# Altium project GSMMHMUltraSlim.PrjPcb
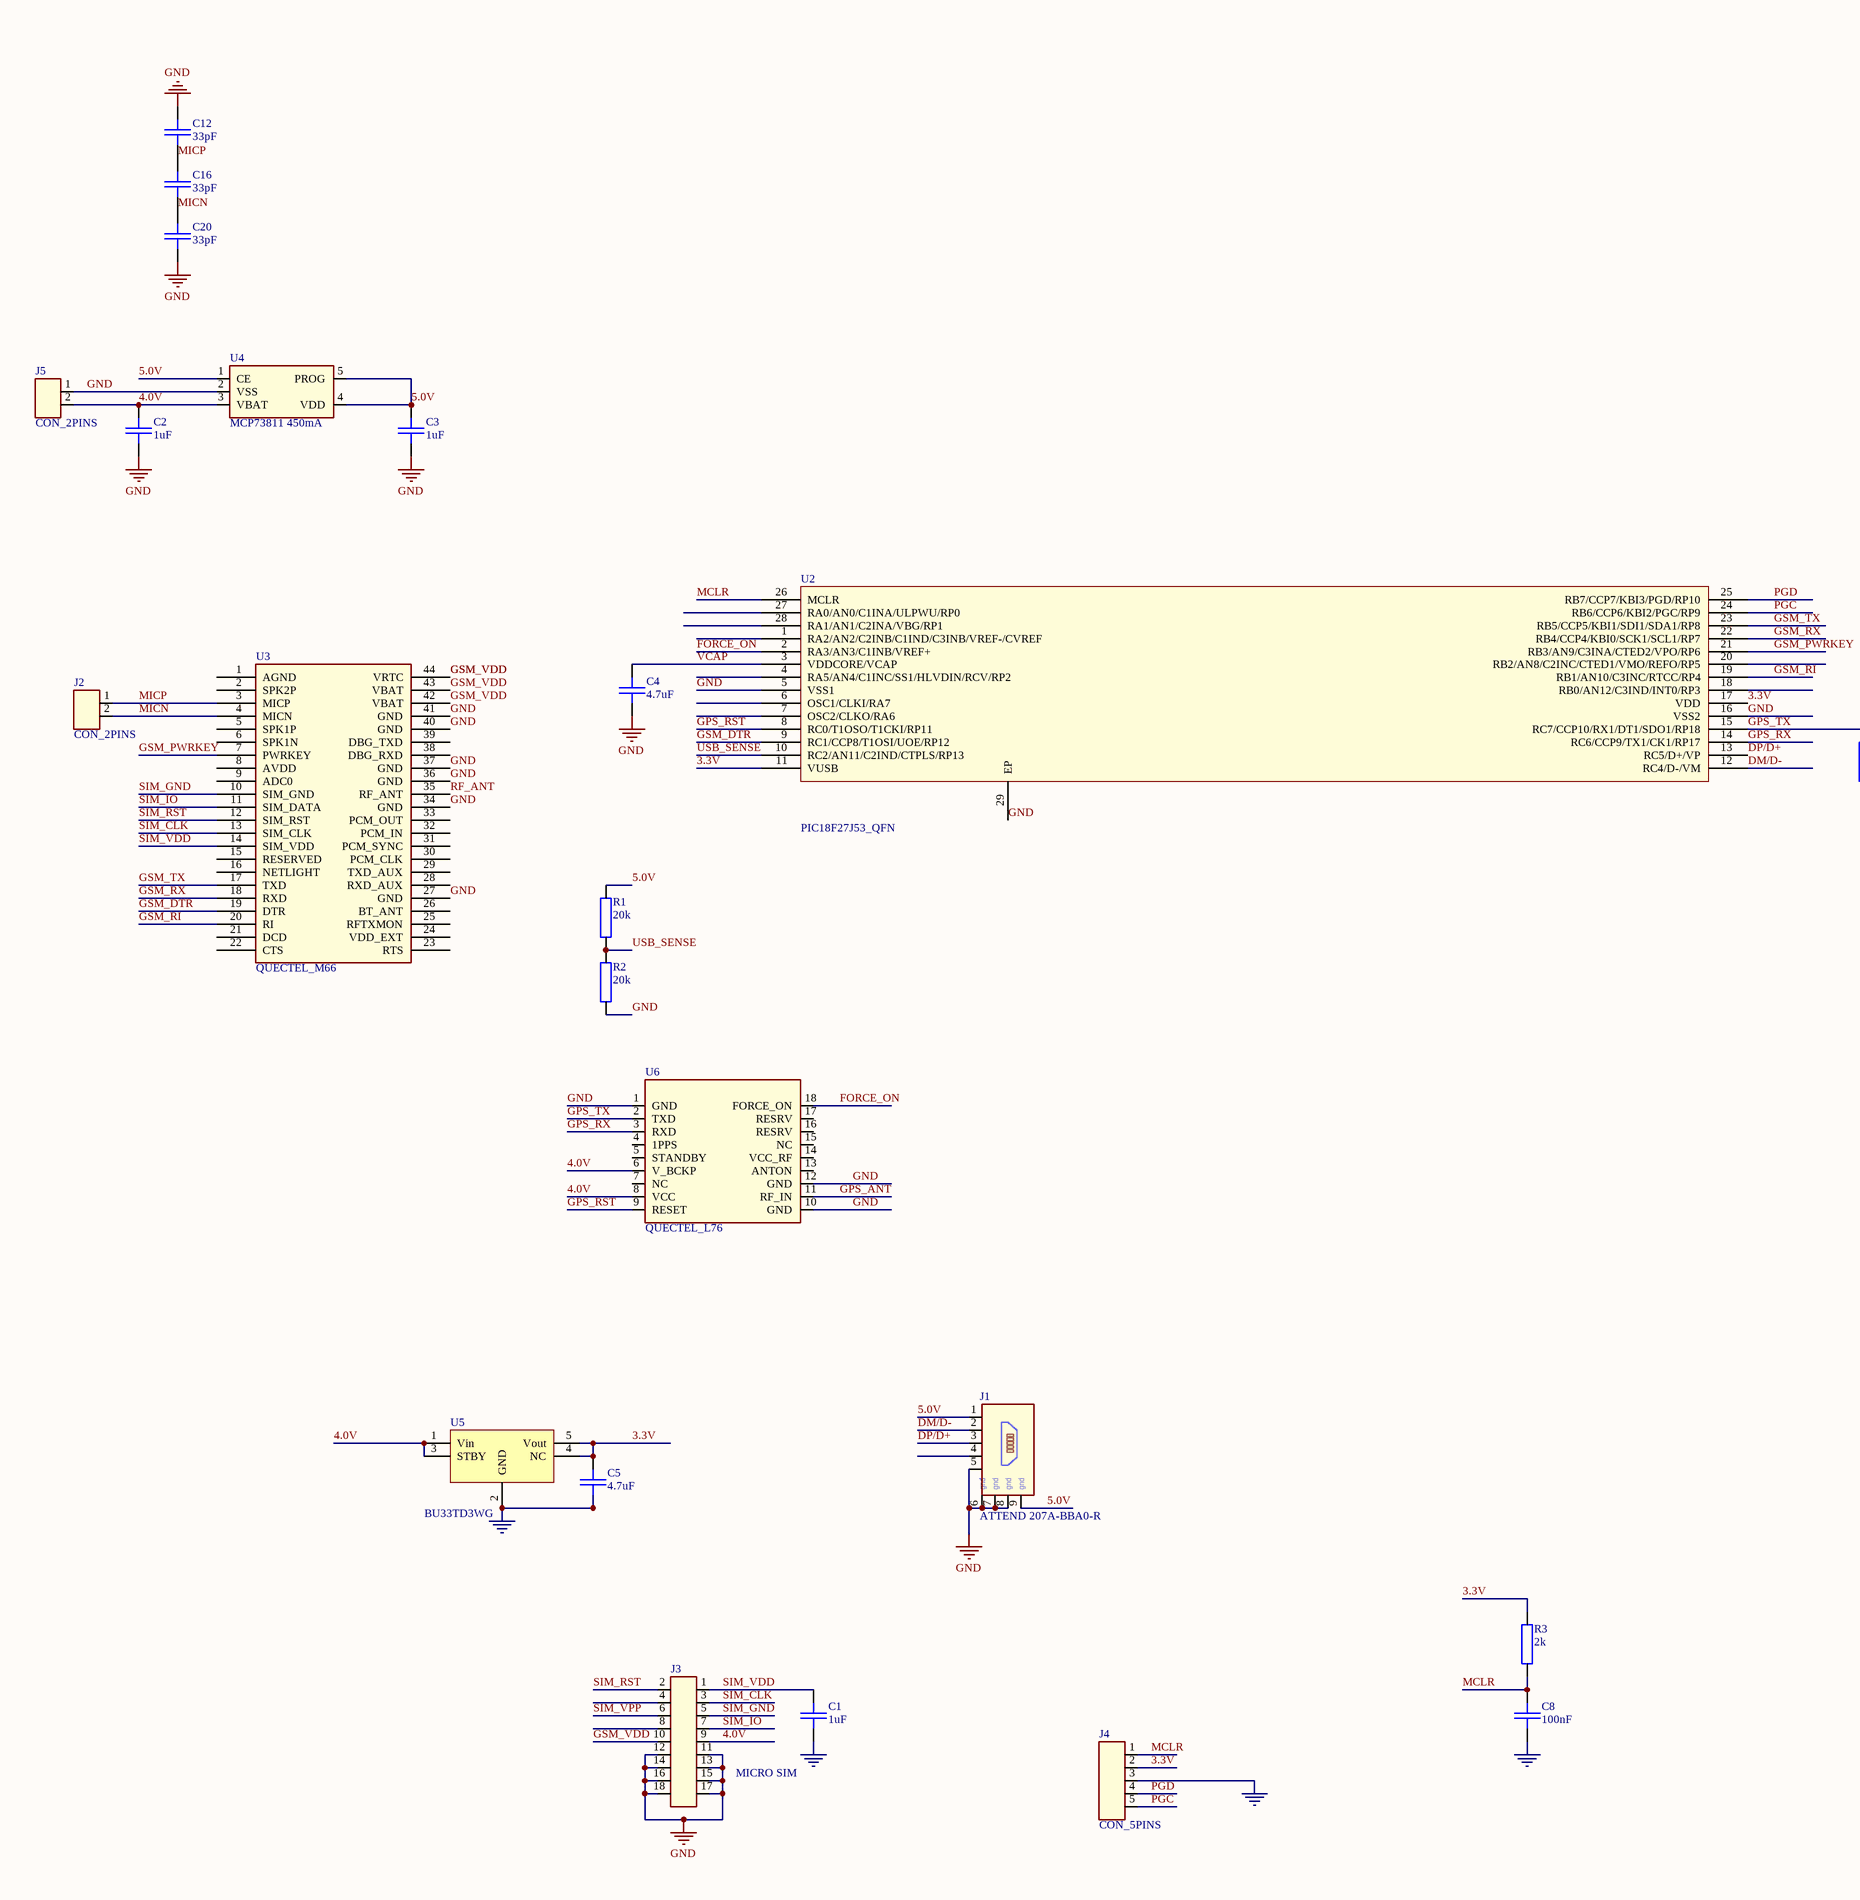
[diagram p0: GSMMHMUltraSlim.SchDoc, left]
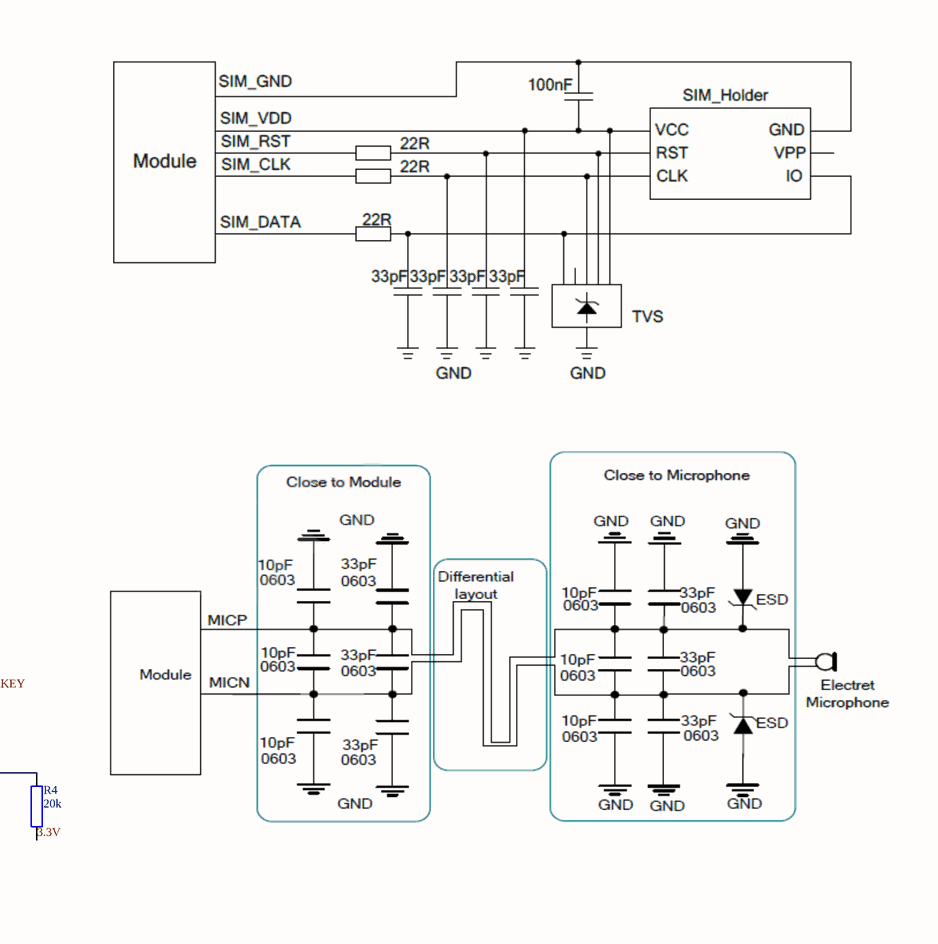
[diagram p1: GSMMHMUltraSlim.SchDoc, right]
1 sheet, 23 parts. Net scope: global (net labels, ports and power ports of the same name join across sheets).
Board file: GSMMHMUltraSlim.PcbDoc

## Sheet GSMMHMUltraSlim.SchDoc
size A2

### Parts
C1  1uF  [SMD_0603_CAPC1608X95N]
C2  1uF  [SMD_0603_CAPC1608X95N]
C3  1uF  [SMD_0603_CAPC1608X95N]
C4  4.7uF  [SMD_0603_CAPC1608X95N]
C5  4.7uF  [SMD_0603_CAPC1608X95N]
C8  100nF  [SMD_0603_CAPC1608X95N]
C12  33pF  [SMD_0603_CAPC1608X95N]
C16  33pF  [SMD_0603_CAPC1608X95N]
C20  33pF  [SMD_0603_CAPC1608X95N]
J1  ATTEND 207A-BBA0-R  [SMD_CON_MICRO_USB]
J2  CON_2PINS  [SMD_MIC_4MM]
J3  MICRO SIM  [SMD_CON-WURTH_MICRO_SIM_693021010811]
J4  CON_5PINS  [SIP5 - PGM]
J5  CON_2PINS  [PTH_HDRV02W64P254_1X02]
R1  20k  [SMD_0603_RESC1608X55N]
R2  20k  [SMD_0603_RESC1608X55N]
R3  2k  [SMD_0603_RESC1608X55N]
R4  20k  [SMD_0603_RESC1608X55N]
U2  PIC18F27J53_QFN  [SMD_QFN65P600X600X100-29AN]
U3  QUECTEL_M66  [SMD_MOD_M66-44N - NO UNUSED PINS]
U4  MCP73811 450mA  [SMD_SOT26_SOT95P285X140-5N - DLV]
U5  BU33TD3WG  [SMD_SOT26_SOT95P285X140-5N - DLV]
U6  QUECTEL_L76  [SMD_MOD_L76_SOIC110P970X1010-18N - NO UNUSED PINS]

### Nets
GND: C1.2 C2.2 C3.2 C4.2 C5.2 C8.2 C12.1 C20.2 J1.5 J1.6 J1.7 J1.8 J3.11 J3.12 J3.13 J3.14 J3.15 J3.16 J3.17 J3.18 J4.3 J5.1 R2.1 U2.5(VSS1) U2.16(VSS2) U2.29(EP) U3.27(GND) U3.34(GND) U3.36(GND) U3.37(GND) U3.40(GND) U3.41(GND) U4.2(VSS) U5.2(GND) U6.1(GND) U6.10(GND) U6.12(GND)
3.3V: C5.1 J4.2 R3.1 R4.1 U2.11(VUSB) U2.17(VDD) U5.4(NC) U5.5(Vout)
4.0V: C2.1 J3.9 J5.2 U4.3(VBAT) U5.1(Vin) U5.3(STBY) U6.6(V_BCKP) U6.8(VCC)
5.0V: C3.1 J1.1 J1.9 R1.2 U4.1(CE) U4.4(VDD) U4.5(PROG)
DM/D-: J1.2 U2.12(RC4/D-/VM)
DP/D+: J1.3 U2.13(RC5/D+/VP)
FORCE_ON: U2.2(RA3/AN3/C1INB/VREF+) U6.18(FORCE_ON)
GPS_ANT: U6.11(RF_IN)
GPS_RST: U2.8(RC0/T1OSO/T1CKI/RP11) U6.9(RESET)
GPS_RX: U2.14(RC6/CCP9/TX1/CK1/RP17) U6.3(RXD)
GPS_TX: R4.2 U2.15(RC7/CCP10/RX1/DT1/SDO1/RP18) U6.2(TXD)
GSM_DTR: U2.9(RC1/CCP8/T1OSI/UOE/RP12) U3.19(DTR)
GSM_PWRKEY: U2.21(RB3/AN9/C3INA/CTED2/VPO/RP6) U3.7(PWRKEY)
GSM_RI: U2.19(RB1/AN10/C3INC/RTCC/RP4) U3.20(RI)
GSM_RX: U2.22(RB4/CCP4/KBI0/SCK1/SCL1/RP7) U3.18(RXD)
GSM_TX: U2.23(RB5/CCP5/KBI1/SDI1/SDA1/RP8) U3.17(TXD)
GSM_VDD: J3.10 U3.42(VBAT) U3.43(VBAT) U3.44(VRTC)
MCLR: C8.1 J4.1 R3.2 U2.26(MCLR)
MICN: C16.2 C20.1 J2.2 U3.4(MICN)
MICP: C12.2 C16.1 J2.1 U3.3(MICP)
PGC: J4.5 U2.24(RB6/CCP6/KBI2/PGC/RP9)
PGD: J4.4 U2.25(RB7/CCP7/KBI3/PGD/RP10)
RF_ANT: U3.35(RF_ANT)
SIM_CLK: J3.3 U3.13(SIM_CLK)
SIM_GND: J3.5 U3.10(SIM_GND)
SIM_IO: J3.7 U3.11(SIM_DATA)
SIM_RST: J3.2 U3.12(SIM_RST)
SIM_VDD: C1.1 J3.1 U3.14(SIM_VDD)
SIM_VPP: J3.6
USB_SENSE: R1.1 R2.2 U2.10(RC2/AN11/C2IND/CTPLS/RP13)
VCAP: C4.1 U2.3(VDDCORE/VCAP)

Not connected (* = marked no-connect by the designer): J1 4; J3 4 8; U2 1(RA2/AN2/C2INB/C1IND/C3INB/VREF-/CVREF) 4(RA5/AN4/C1INC/SS1/HLVDIN/RCV/RP2) 6(OSC1/CLKI/RA7) 7(OSC2/CLKO/RA6) 18(RB0/AN12/C3IND/INT0/RP3) 20(RB2/AN8/C2INC/CTED1/VMO/REFO/RP5) 27(RA0/AN0/C1INA/ULPWU/RP0) 28(RA1/AN1/C2INA/VBG/RP1); U3 1(AGND) 2(SPK2P) 5(SPK1P) 6(SPK1N) 8(AVDD) 9(ADC0) 15(RESERVED) 16(NETLIGHT) 21(DCD) 22(CTS) 23(RTS) 24(VDD_EXT) 25(RFTXMON) 26(BT_ANT) 28(RXD_AUX) 29(TXD_AUX) 30(PCM_CLK) 31(PCM_SYNC) 32(PCM_IN) 33(PCM_OUT) 38(DBG_RXD) 39(DBG_TXD); U6 4(1PPS) 5(STANDBY) 7(NC) 13(ANTON) 14(VCC_RF) 15(NC) 16(RESRV) 17(RESRV)

### Notes on the sheet
- (in symbol CON_USB_MINI) gnd

### Library data of the parts
C1-C5 C8 C12 C16 C20 = C: NOTE: <NOTE>
J1 = CON_USB_MINI: NOTE: <NOTE>
J2 J5 = CON_2PINS: NOTE: <NOTE>
J3 = CON_2ROWS_18PINS
J4 = CON_5PINS: NOTE: <NOTE>
R1-R4 = R: NOTE: <NOTE>; R_BDS: R
U2 = IC_PIC18F27J53_QFN
U3 = MOD_QUECTEL_M66
U4 = IC_MCP73812: MCP73812; DB_PART_NUMBER: PSU000000127; DB_PART_TYPE: Linear Voltage Regulator; DB_MANUFACTURER_PART: ROHM        BD33KA5WF-E2; DB_T_RANGE: -40 to 105; DB_VOLTAGE: 3.3V; DB_CURRENT: 500mA; DB_PACKAGE: SOIC-8; DB_DESCRIPTION: IC BD33KA5WF-E2 SOIC-8; DB_PCB_DEVICE: SMD_SOIC127P620X160-8N; DB_CERTIFIED: ISHIDDEN=T; DB_APPROVED_BY: VSN; DB_APPROVED_ON: 07.5.2014 г. 13:18:28; DB_STATUS: NEW; DB_DATASHEET: http://john.epiqdesign.com/projects/CIS_Datasheets/IC_bdxxka5wf-e-209388.pdf?rev=1408&sc=0
U5 = IC_BU33TD3WG
U6 = MOD_QUECTEL_L76

## Assembly variants
Production: not fitted Q1 Q2